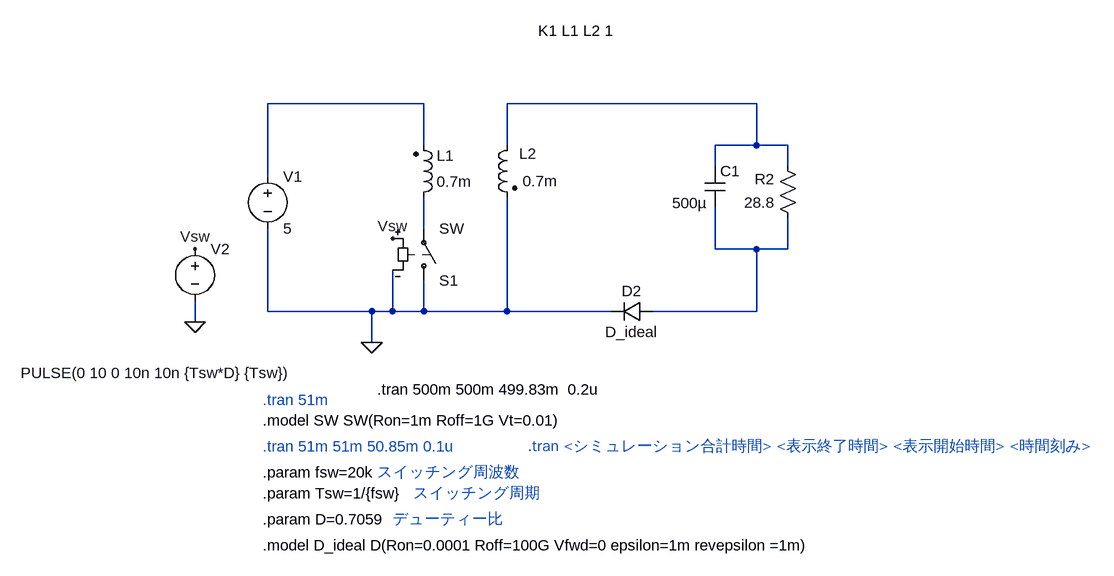
[diagram p0: schematic prof_09_flyback_converter_boost.asc]
prof_09_flyback_converter_boost.asc, the LTspice schematic file:
Version 4
SHEET 1 1264 928
WIRE 288 80 48 80
WIRE 800 80 416 80
WIRE 288 144 288 80
WIRE 416 144 416 80
WIRE 800 144 800 80
WIRE 800 144 736 144
WIRE 848 144 800 144
WIRE 736 176 736 144
WIRE 848 176 848 144
WIRE 48 192 48 80
WIRE 288 272 288 224
WIRE 736 304 736 240
WIRE 800 304 736 304
WIRE 848 304 848 256
WIRE 848 304 800 304
WIRE 48 400 48 272
WIRE 208 400 48 400
WIRE 240 400 240 336
WIRE 240 400 208 400
WIRE 288 400 288 352
WIRE 288 400 240 400
WIRE 416 400 416 224
WIRE 416 400 288 400
WIRE 576 400 416 400
WIRE 800 400 800 304
WIRE 800 400 640 400
WIRE -64 416 -64 384
WIRE 208 448 208 400
FLAG -64 416 0
FLAG -64 304 Vsw
FLAG 240 288 Vsw
FLAG 208 448 0
SYMBOL ind2 272 240 M180
WINDOW 0 36 80 Left 2
WINDOW 3 36 40 Left 2
SYMATTR InstName L1
SYMATTR Value 0.7m
SYMATTR SpiceLine Rser=0.001
SYMBOL ind2 432 128 M0
WINDOW 0 -30 29 Left 2
WINDOW 3 -62 71 Left 2
SYMATTR InstName L2
SYMATTR Value 0.7m
SYMATTR SpiceLine Rser=0.001m
SYMBOL sw 288 368 M180
SYMATTR InstName S1
SYMBOL voltage 48 176 R0
SYMATTR InstName V1
SYMATTR Value 5
SYMBOL diode 640 384 R90
WINDOW 0 0 32 VBottom 2
WINDOW 3 32 32 VTop 2
SYMATTR InstName D2
SYMATTR Value D_ideal
SYMBOL res 864 272 R180
WINDOW 0 36 76 Left 2
WINDOW 3 36 40 Left 2
SYMATTR InstName R2
SYMATTR Value 28.8
SYMBOL cap 720 176 R0
WINDOW 3 -50 57 Left 2
SYMATTR InstName C1
SYMATTR Value 500µ
SYMBOL voltage -64 288 R0
WINDOW 3 -268 207 Left 2
SYMATTR Value PULSE(0 10 0 10n 10n {Tsw*D} {Tsw})
SYMATTR InstName V2
TEXT 40 568 Left 2 !.model SW SW(Ron=1m Roff=1G Vt=0.01)
TEXT 40 608 Left 2 ;.tran 51m 51m 50.85m 0.1u
TEXT 40 648 Left 2 !.param fsw=20k
TEXT 40 680 Left 2 !.param Tsw=1/{fsw}
TEXT 40 720 Left 2 !.param D=0.7059
TEXT 240 720 Left 2 ;デューティー比
TEXT 272 680 Left 2 ;スイッチング周期
TEXT 216 648 Left 2 ;スイッチング周波数
TEXT 448 608 Left 2 ;.tran <シミュレーション合計時間> <表示終了時間> <表示開始時間> <時間刻み>
TEXT 40 760 Left 2 !.model D_ideal D(Ron=0.0001 Roff=100G Vfwd=0 epsilon=1m revepsilon =1m)
TEXT 464 -32 Left 2 !K1 L1 L2 1
TEXT 40 536 Left 2 ;.tran 51m
TEXT 216 520 Left 2 !.tran 500m 500m 499.83m  0.2u

The netlist it stands for:
* prof_09_flyback_converter_boost.asc
L1 N003 N001 0.7m Rser=0.001
L2 N002 0 0.7m Rser=0.001m
S1 0 N003 Vsw 0 SW
V1 N001 0 5
D2 N004 0 D_ideal
R2 N004 N002 28.8
C1 N002 N004 500µ
V2 Vsw 0 PULSE(0 10 0 10n 10n {Tsw*D} {Tsw})
.model D D
.lib standard.dio
.model SW SW(Ron=1m Roff=1G Vt=0.01)
* .tran 51m 51m 50.85m 0.1u
.param fsw=20k
.param Tsw=1/{fsw}
.param D=0.7059
* デューティー比
* スイッチング周期
* スイッチング周波数
* .tran <シミュレーション合計時間> <表示終了時間> <表示開始時間> <時間刻み>
.model D_ideal D(Ron=0.0001 Roff=100G Vfwd=0 epsilon=1m revepsilon =1m)
K1 L1 L2 1
* .tran 51m
.tran 500m 500m 499.83m  0.2u
.backanno
.end